# EAGLE board Motherboard (EAGLE 6.5.0)
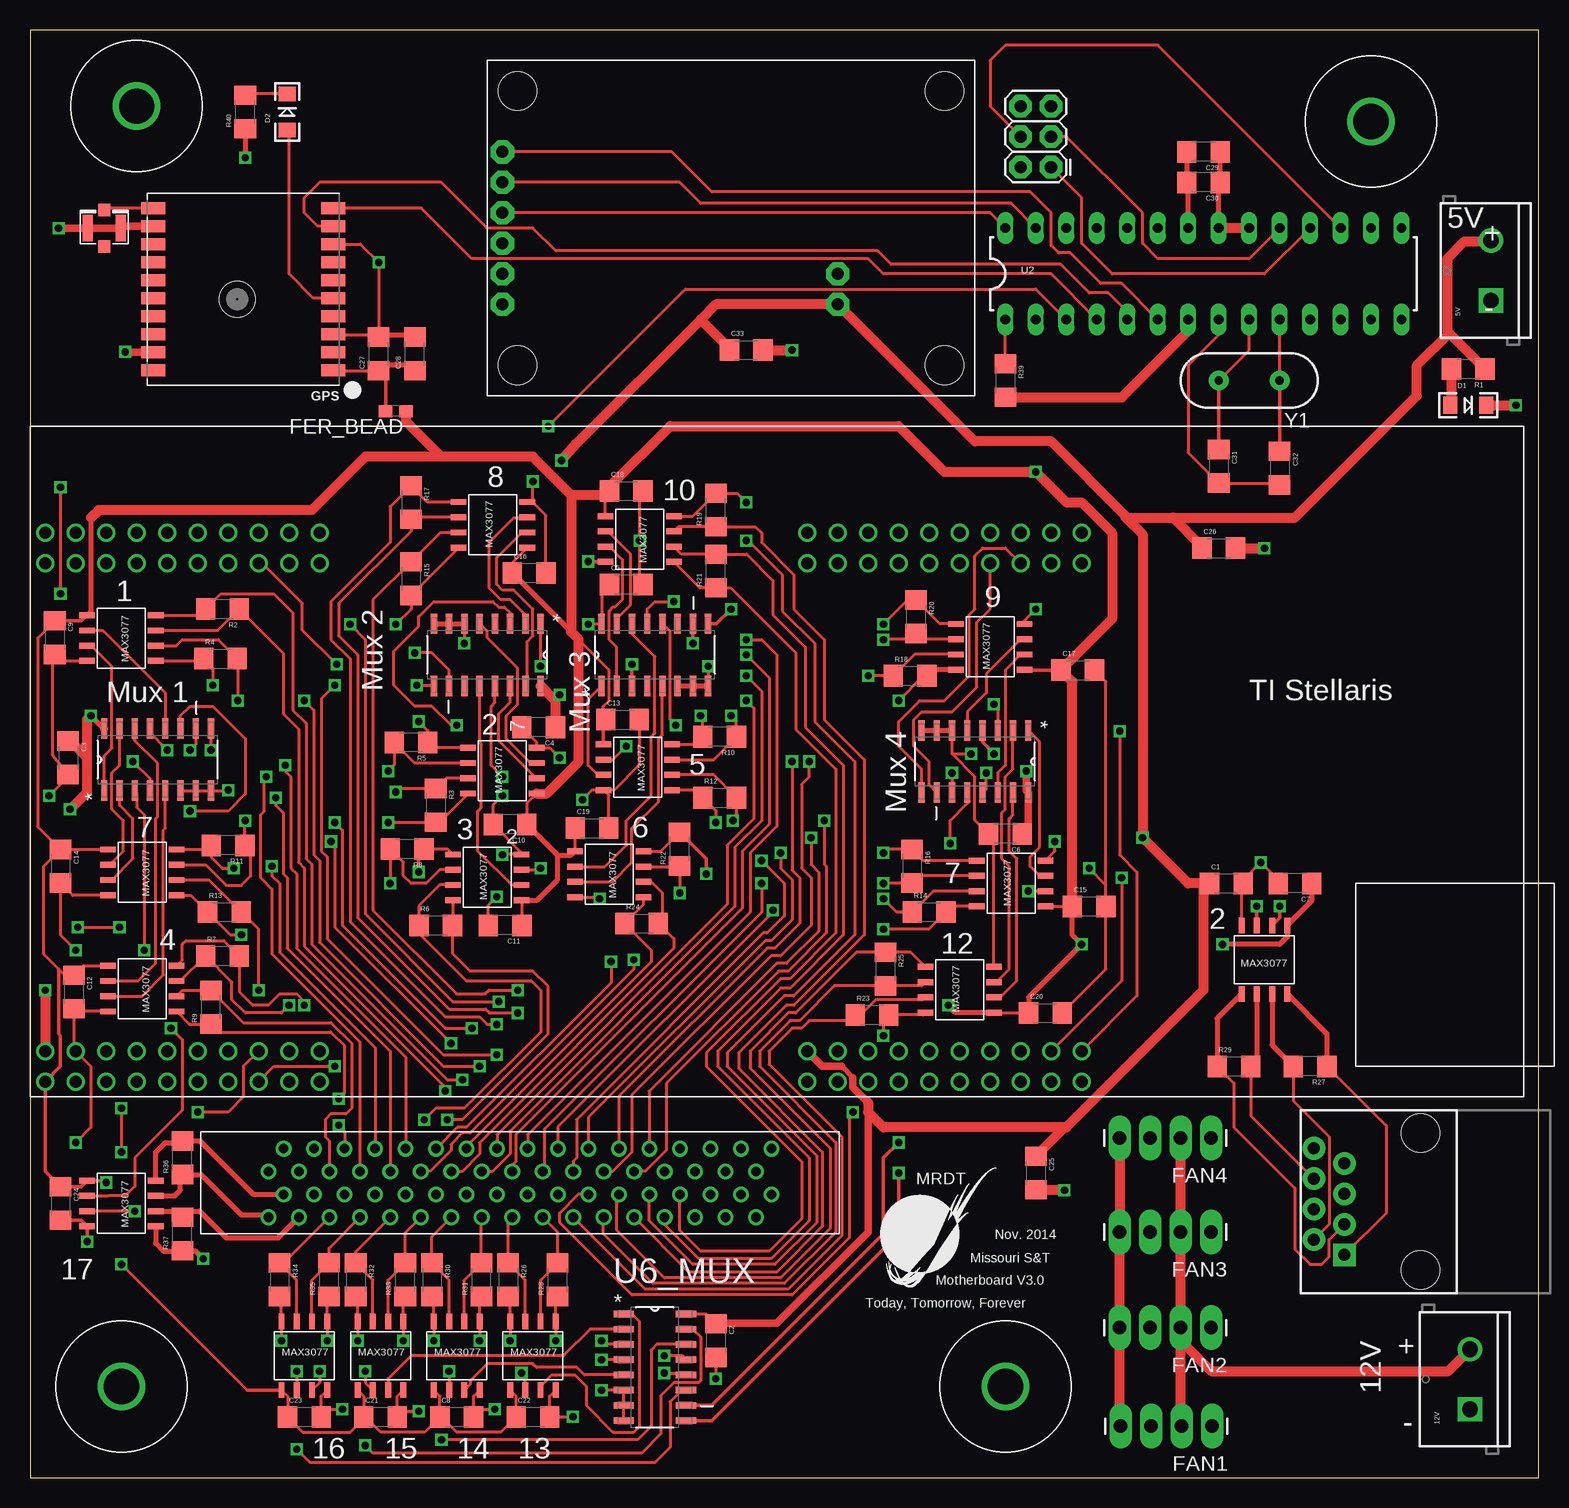
[diagram p7: board, top side]
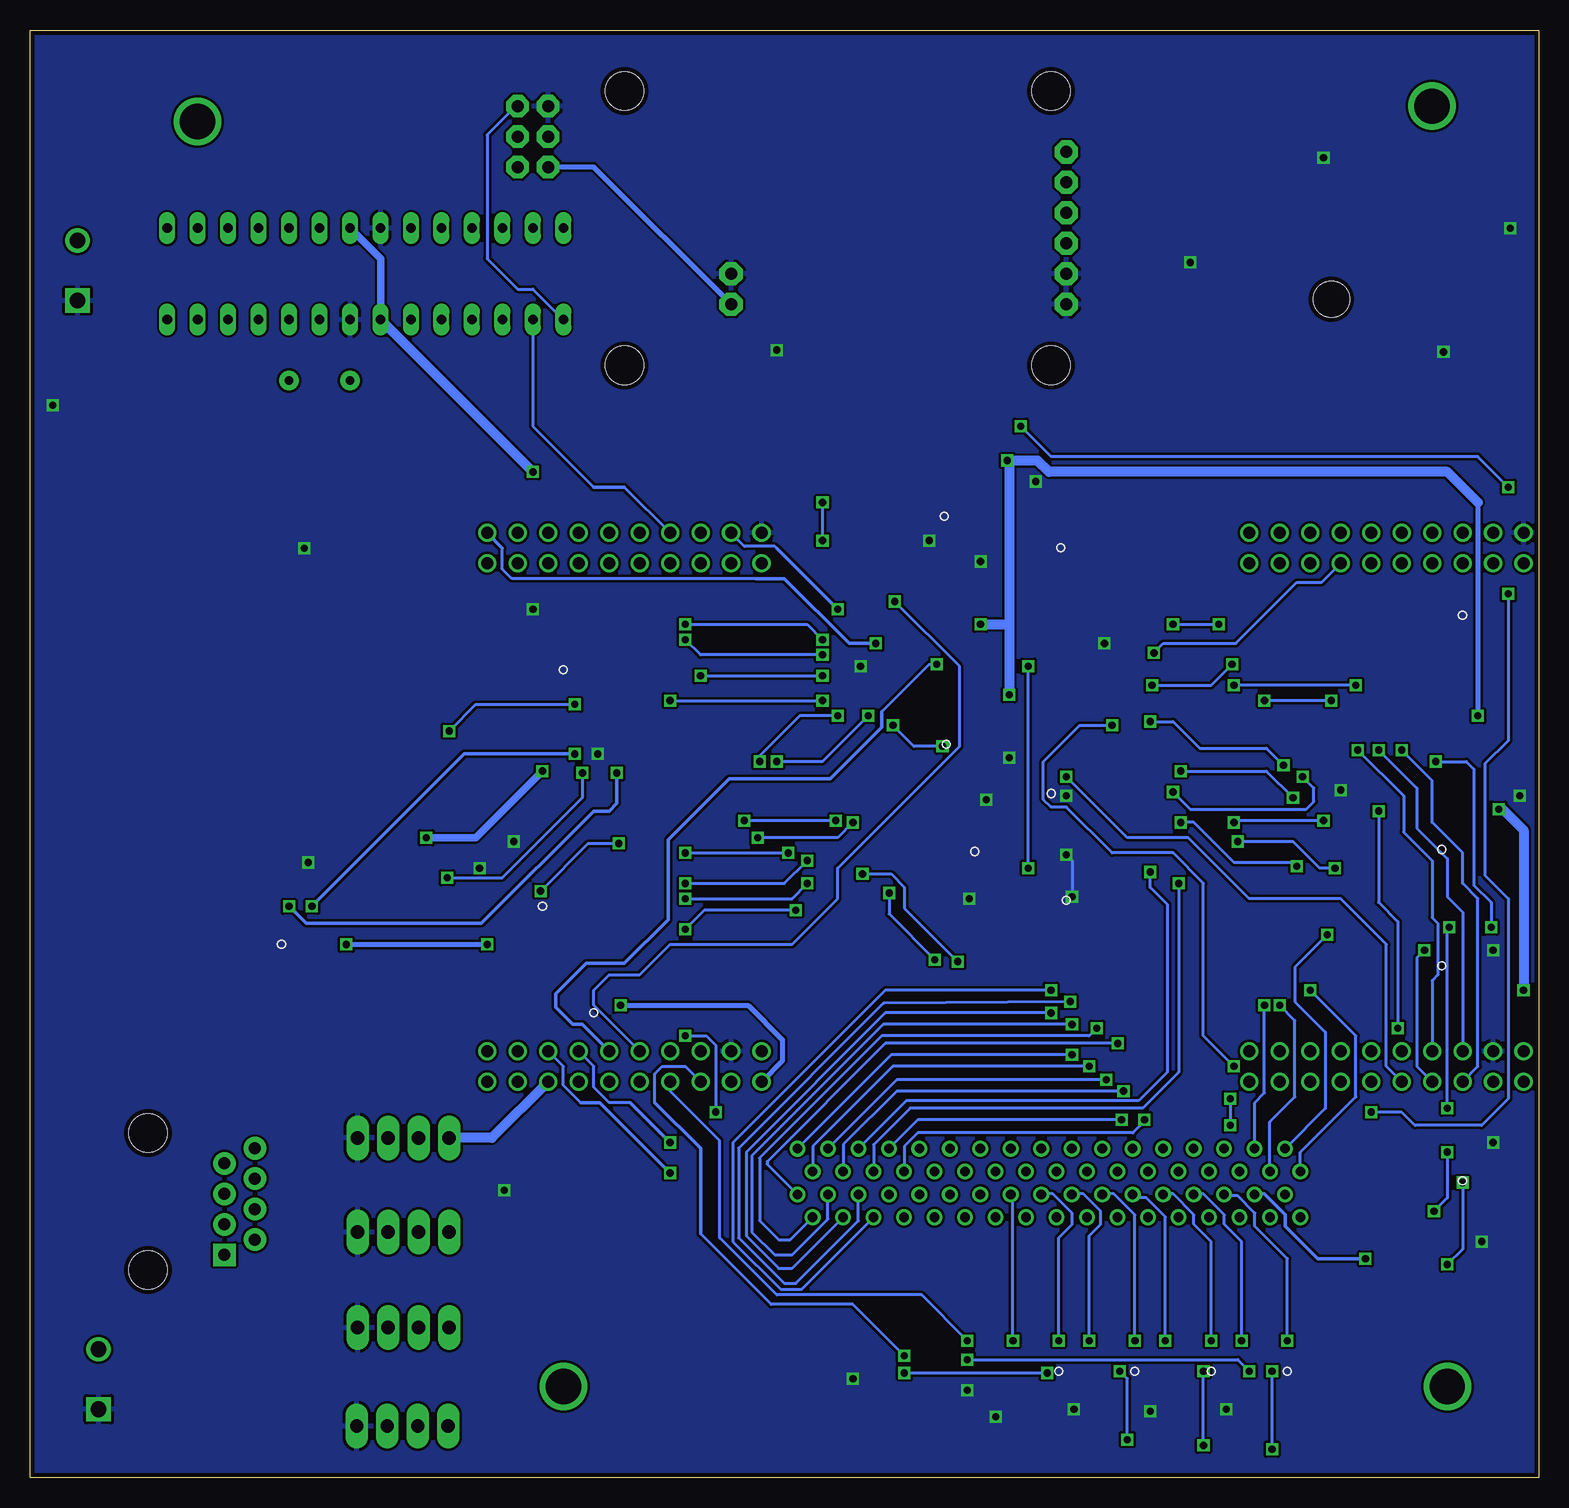
[diagram p8: board, bottom side, seen from below]

Size 125.73 x 120.65 mm. Coordinates in mm from the lower left corner, seen from the top.
Outline: 0,0 125.73,0 125.73,120.65 0,120.65 0,0
Copper layers (1*16): Top 0.035559375mm / dielectric 1.501140625mm / Bottom 0.035559375mm
Design rules "default": minimum track width 10mil, minimum drill 15mil, track to track 8mil, track to pad 6mil, pad to pad 6mil, via to via 6mil, smd to smd 6mil, copper to edge 15mil, drill to drill 8mil, minimum pad ring 10mil, minimum via ring 8mil, stop-mask expansion 4mil, vias tented up to drill 0mil, thermal gap 10mil
tRestrict: area 161,29.2 to 168.4,29.2

## Footprints (pad centres in the part's own frame; a part is rotated, then mirrored left to right if it is on the bottom)
SCREWTERMINAL-5MM-2 = drill 1.3 pad 2.032 square: 1 0,0 | drill 1.3 pad 2.032: 2 5,0
1206 = smd 1.6 x 1.8: 1 -1.4,0; 2 1.4,0
LED-1206 = smd 1.2 x 1.4: A -1.5,0; C 1.5,0
1X04_LONGPADS = drill 1.118 pad 1.88 long: 1 0,0; 2 2.54,0; 3 5.08,0; 4 7.62,0
0603 = smd 1.1 x 1: 1 -0.85,0; 2 0.85,0
FGPMMOPA6H = smd 2 x 1: P$1 -7.5,6.75; P$2 -7.5,5.25; P$3 -7.5,3.75; P$4 -7.5,2.25; P$5 -7.5,0.75; P$6 -7.5,-0.75; P$7 -7.5,-2.25; P$8 -7.5,-3.75; P$9 -7.5,-5.25; P$10 -7.5,-6.75; P$11 7.5,-6.75; P$12 7.5,-5.25; P$13 7.5,-3.75; P$14 7.5,-2.25; P$15 7.5,-0.75; P$16 7.5,0.75; P$17 7.5,2.25; P$18 7.5,3.75; P$19 7.5,5.25; P$20 7.5,6.75 | hole 3: 0.5,0.85
H_MNTHOLE_#4 = drill 2.946: 1 0,0
U.FL = smd 2.2 x 0.85: P$1 0,1.375; P$2 0,-1.375 | smd 1.05 x 1: P$3 1.525,0; P$4 -1.525,0
2X3 = drill 1.016 pad 1.88 octagon: 1 0,0; 2 0,2.54; 3 2.54,0; 4 2.54,2.54; 5 5.08,0; 6 5.08,2.54
MAX3070E = smd 0.49 x 1.3: A -1.905,2.857; B -0.635,2.857; DI 0.635,-2.857; GND 1.905,-2.857; RO -0.635,-2.857; VCC -1.905,-2.857; Y 1.905,2.857; Z 0.635,2.857
DIL28-3 = drill 0.813 long: 1 -16.51,-3.81; 2 -13.97,-3.81; 3 -11.43,-3.81; 4 -8.89,-3.81; 5 -6.35,-3.81; 6 -3.81,-3.81; 7 -1.27,-3.81; 8 1.27,-3.81; 9 3.81,-3.81; 10 6.35,-3.81; 11 8.89,-3.81; 12 11.43,-3.81; 13 13.97,-3.81; 14 16.51,-3.81; 15 16.51,3.81; 16 13.97,3.81; 17 11.43,3.81; 18 8.89,3.81; 19 6.35,3.81; 20 3.81,3.81; 21 1.27,3.81; 22 -1.27,3.81; 23 -3.81,3.81; 24 -6.35,3.81; 25 -8.89,3.81; 26 -11.43,3.81; 27 -13.97,3.81; 28 -16.51,3.81
SOIC127P600X175-16N = smd 1.702 x 0.533: 1 -2.591,4.445; 2 -2.591,3.175; 3 -2.591,1.905; 4 -2.591,0.635; 5 -2.591,-0.635; 6 -2.591,-1.905; 7 -2.591,-3.175; 8 -2.591,-4.445; 9 2.591,-4.445; 10 2.591,-3.175; 11 2.591,-1.905; 12 2.591,-0.635; 13 2.591,0.635; 14 2.591,1.905; 15 2.591,3.175; 16 2.591,4.445
RAZOR_IMU = drill 1 pad 1.93 octagon: 3.3V -19.05,-1.27; CTS -19.05,-3.81; DTR -19.05,6.35; GND_1 -19.05,-6.35; GND_2 8.89,-3.81; RXI -19.05,1.27; TXO -19.05,3.81; VCC 8.89,-6.35 | hole 3.2: -17.78,11.43; 17.78,11.43; 17.78,-11.43; -17.78,-11.43
RJ45-8 = drill 1 pad 1.88 square: 1 -4.445,6.35 | drill 1 pad 1.88: 2 -3.175,8.89; 3 -1.905,6.35; 4 -0.635,8.89; 5 0.635,6.35; 6 1.905,8.89; 7 3.175,6.35; 8 4.445,8.89 | hole 3.2: -5.715,0; 5.715,0
60050685100 = drill 0.8: 1 47.555,7.107; 2 46.285,5.202; 3 45.015,7.107; 4 43.745,5.202; 5 42.475,7.107; 6 41.205,5.202; 7 39.935,7.107; 8 38.665,5.202; 9 37.395,7.107; 10 36.125,5.202; 11 34.855,7.107; 12 33.585,5.202; 13 32.315,7.107; 14 31.045,5.202; 15 29.775,7.107; 16 28.505,5.202; 17 27.235,7.107; 18 25.965,5.202; 19 24.695,7.107; 20 23.425,5.202; 21 22.155,7.107; 22 20.885,5.202; 23 19.615,7.107; 24 18.345,5.202; 25 17.075,7.107; 26 15.805,5.202; 27 14.535,7.107; 28 13.265,5.202; 29 11.995,7.107; 30 10.725,5.202; 31 9.455,7.107; 32 8.185,5.202; 33 6.915,7.107; 34 5.645,5.202; 35 47.555,3.297; 36 46.285,1.393; 37 45.015,3.297; 38 43.745,1.393; 39 42.475,3.297; 40 41.205,1.393; 41 39.935,3.297; 42 38.665,1.393; 43 37.395,3.297; 44 36.125,1.393; 45 34.855,3.297; 46 33.585,1.393; 47 32.315,3.297; 48 31.045,1.393; 49 29.775,3.297; 50 28.505,1.393; 51 27.235,3.297; 52 25.965,1.393; 53 24.695,3.297; 54 23.425,1.393; 55 22.155,3.297; 56 20.885,1.393; 57 19.615,3.297; 58 18.345,1.393; 59 17.075,3.297; 60 15.805,1.393; 61 14.535,3.297; 62 13.265,1.393; 63 11.995,3.297; 64 10.725,1.393; 65 9.455,3.297; 66 8.185,1.393; 67 6.915,3.297; 68 5.645,1.393
STELLARISLAUNCHPAD_CONNECTED = drill 1: P1 36.83,54.61; P2 39.37,54.61; P3 41.91,54.61; P4 44.45,54.61; P5 46.99,54.61; P6 49.53,54.61; P7 52.07,54.61; P8 54.61,54.61; P9 57.15,54.61; P10 59.69,54.61; P11 36.83,52.07; P12 39.37,52.07; P13 41.91,52.07; P14 44.45,52.07; P15 46.99,52.07; P16 49.53,52.07; P17 52.07,52.07; P18 54.61,52.07; P19 57.15,52.07; P20 59.69,52.07; P21 100.33,54.61; P22 102.87,54.61; P23 105.41,54.61; P24 107.95,54.61; P25 110.49,54.61; P26 113.03,54.61; P27 115.57,54.61; P28 118.11,54.61; P29 120.65,54.61; P30 123.19,54.61; P31 100.33,52.07; P32 102.87,52.07; P33 105.41,52.07; P34 107.95,52.07; P35 110.49,52.07; P36 113.03,52.07; P37 115.57,52.07; P38 118.11,52.07; P39 120.65,52.07; P40 123.19,52.07; P41 36.83,11.43; P42 39.37,11.43; P43 41.91,11.43; P44 44.45,11.43; P45 46.99,11.43; P46 49.53,11.43; P47 52.07,11.43; P48 54.61,11.43; P49 57.15,11.43; P50 59.69,11.43; P51 36.83,8.89; P52 39.37,8.89; P53 41.91,8.89; P54 44.45,8.89; P55 46.99,8.89; P56 49.53,8.89; P57 52.07,8.89; P58 54.61,8.89; P59 57.15,8.89; P60 59.69,8.89; P61 100.33,11.43; P62 102.87,11.43; P63 105.41,11.43; P64 107.95,11.43; P65 110.49,11.43; P66 113.03,11.43; P67 115.57,11.43; P68 118.11,11.43; P69 120.65,11.43; P70 123.19,11.43; P71 100.33,8.89; P72 102.87,8.89; P73 105.41,8.89; P74 107.95,8.89; P75 110.49,8.89; P76 113.03,8.89; P77 115.57,8.89; P78 118.11,8.89; P79 120.65,8.89; P80 123.19,8.89
HC49US = drill 0.7 pad 1.651: 1 -2.54,0; 2 2.54,0

## Placement (x,y rotation side)
5V  M025MM  [SCREWTERMINAL-5MM-2]  121.76,98.11 90 top
12V  M025MM  [SCREWTERMINAL-5MM-2]  120.02,5.71 90 top
C1  0.1uF  [1206]  99.69,49.53 0 top
C2  0.1uF  [1206]  57.15,11.43 270 top
C3  0.1uF  [1206]  3.17,60.01 270 top
C4  0.1uF  [1206]  42.39,62.55 180 top
C5  0.1uF  [1206]  49.69,74.45 0 top
C6  0.1uF  [1206]  81.28,53.66 180 top
C7  0.1uF  [1206]  105.41,49.53 180 top
C8  0.1uF  [1206]  35.56,5.08 0 top
C9  0.1uF  [1206]  2.06,70.01 270 top
C10  0.1uF  [1206]  40.01,54.45 180 top
C11  0.1uF  [1206]  39.59,46.04 180 top
C12  0.1uF  [1206]  3.65,40.48 270 top
C13  0.1uF  [1206]  49.37,63.18 0 top
C14  0.1uF  [1206]  2.54,50.96 270 top
C15  0.1uF  [1206]  88.27,47.62 0 top
C16  0.1uF  [1206]  41.59,75.41 0 top
C17  0.1uF  [1206]  87.31,67.31 0 top
C18  0.1uF  [1206]  49.69,82.23 0 top
C19  0.1uF  [1206]  46.83,54.13 0 top
C20  0.1uF  [1206]  84.61,38.73 0 top
C21  0.1uF  [1206]  29.21,5.08 0 top
C22  0.1uF  [1206]  41.91,5.08 0 top
C23  0.1uF  [1206]  22.86,5.08 0 top
C24  0.1uF  [1206]  2.54,22.86 270 top
C25  0.1uF  [1206]  83.82,25.4 270 top
C26  0.1uF  [1206]  99.06,77.47 0 top
C27  .01uF  [1206]  29.05,93.66 90 top
C28  1uF  [1206]  32.07,93.66 90 top
C29  0.1uF  [1206]  97.79,110.49 180 top
C30  0.1uF  [1206]  97.79,107.95 180 top
C31  22pF  [1206]  99.06,84.3 270 top
C32  22pF  [1206]  104.14,84.14 270 top
C33  0.1uF  [1206]  59.69,93.98 0 top
D1  GREEN  [LED-1206]  119.86,89.38 0 top
D2  RED  [LED-1206]  21.43,113.82 90 top
FAN1  [1X04_LONGPADS]  98.5,4.3 180 top
FAN2  [1X04_LONGPADS]  98.42,12.51 180 top
FAN3  [1X04_LONGPADS]  98.42,20.48 180 top
FAN4  [1X04_LONGPADS]  98.42,28.32 180 top
FER_BEAD  10_ohm  [0603]  30.48,88.9 180 top
GPS  [FGPMMOPA6H]  17.78,99.06 180 top
H1  [H_MNTHOLE_#4]  81.28,7.62 0 top
H2  [H_MNTHOLE_#4]  7.62,7.62 0 top
H3  [H_MNTHOLE_#4]  111.76,113.03 0 top
H4  [H_MNTHOLE_#4]  8.89,114.3 0 top
J1  U.FL  [U.FL]  6.19,104.14 90 top
J2  AVR_SPI_PRG_6PTH  [2X3]  85.09,109.22 90 top
R1  330  [1206]  119.86,92.39 180 top
R2  120  [1206]  16.03,72.39 180 top
R3  120  [1206]  33.81,56.04 270 top
R4  120  [1206]  15.88,68.26 0 top
R5  120  [1206]  31.75,61.28 180 top
R6  120  [1206]  33.81,46.04 0 top
R7  120  [1206]  16.03,43.5 0 top
R8  120  [1206]  31.43,52.39 180 top
R9  120  [1206]  15.08,39.21 90 top
R10  120  [1206]  57.47,61.75 180 top
R11  120  [1206]  16.51,52.7 180 top
R12  120  [1206]  57.47,56.67 0 top
R13  120  [1206]  16.19,47.15 0 top
R14  120  [1206]  74.93,47.15 0 top
R15  120  [1206]  31.75,74.93 270 top
R16  120  [1206]  73.5,50.96 270 top
R17  120  [1206]  31.75,81.28 270 top
R18  120  [1206]  73.34,66.83 0 top
R19  120  [1206]  57.15,80.64 90 top
R20  120  [1206]  73.82,71.75 270 top
R21  120  [1206]  57.15,75.56 90 top
R22  120  [1206]  54.13,52.39 90 top
R23  120  [1206]  70.17,38.58 0 top
R24  120  [1206]  50.96,46.2 0 top
R25  120  [1206]  71.28,42.39 270 top
R26  120  [1206]  39.85,16.51 270 top
R27  120  [1206]  106.68,34.29 180 top
R28  120  [1206]  43.97,16.51 90 top
R29  120  [1206]  100.33,34.29 0 top
R30  120  [1206]  33.5,16.51 270 top
R31  120  [1206]  37.62,16.51 90 top
R32  120  [1206]  27.15,16.51 270 top
R33  120  [1206]  31.27,16.51 90 top
R34  120  [1206]  20.8,16.51 270 top
R35  120  [1206]  24.92,16.51 90 top
R36  120  [1206]  12.7,26.67 90 top
R37  120  [1206]  12.7,20.32 90 top
R39  10k  [1206]  81.28,91.44 270 top
R40  1K  [1206]  17.94,113.82 90 top
RS-485-2  MAX3077  [MAX3070E]  102.87,43.18 180 top
RS_TRANS_1  MAX3077  [MAX3070E]  7.62,69.98 270 top
RS_TRANS_2  MAX3077  [MAX3070E]  39.37,58.93 90 top
RS_TRANS_3  MAX3077  [MAX3070E]  38.1,50.04 90 top
RS_TRANS_4  MAX3077  [MAX3070E]  9.37,40.77 270 top
RS_TRANS_5  MAX3077  [MAX3070E]  50.64,59.21 270 top
RS_TRANS_6  MAX3077  [MAX3070E]  9.37,50.45 270 top
RS_TRANS_7  MAX3077  [MAX3070E]  81.76,49.53 90 top
RS_TRANS_8  MAX3077  [MAX3070E]  38.58,79.41 90 top
RS_TRANS_9  MAX3077  [MAX3070E]  80.01,69.25 90 top
RS_TRANS_10  MAX3077  [MAX3070E]  50.8,78.23 270 top
RS_TRANS_11  MAX3077  [MAX3070E]  48.26,50.29 270 top
RS_TRANS_12  MAX3077  [MAX3070E]  77.47,40.67 90 top
RS_TRANS_13  MAX3077  [MAX3070E]  41.91,10.16 0 top
RS_TRANS_14  MAX3077  [MAX3070E]  35.56,10.16 0 top
RS_TRANS_15  MAX3077  [MAX3070E]  29.21,10.16 0 top
RS_TRANS_16  MAX3077  [MAX3070E]  22.86,10.16 0 top
RS_TRANS_17  MAX3077  [MAX3070E]  7.62,22.86 270 top
U2  ATMEGA328P_PDIP  [DIL28-3]  97.79,100.33 0 top
U3_MUX  74HC4052D,653  [SOIC127P600X175-16N]  78.74,59.69 270 top
U4_MUX  74HC4052D,653  [SOIC127P600X175-16N]  52.07,68.58 90 top
U5_MUX  74HC4052D,653  [SOIC127P600X175-16N]  38.1,68.58 270 top
U6_MUX  74HC4052D,653  [SOIC127P600X175-16N]  52.07,9.21 0 top
U7_MUX  74HC4052D,653  [SOIC127P600X175-16N]  10.64,59.85 90 top
U$1  RAZOR_IMU  [RAZOR_IMU]  58.42,104.14 0 top
U$2  RJ45-8PTH  [RJ45-8]  115.89,23.02 90 top
U$4  TB60050685100  [60050685100]  14.22,20.32 0 top
U$5  STELLARISLAUNCHPAD_CONNECTED  [STELLARISLAUNCHPAD_CONNECTED]  124.46,87.63 180 top
Y1  8MHz  [HC49US]  101.6,91.44 180 top

## Tracks (layer width: path | path; a pad name or v marks a point on that pad's centre or on a via)
1_RX+  (via drill 0.6)
  Top 0.254: v36.04,33.18 34.77,33.18 23.5,44.45 23.5,51.12 23.02,51.59 23.02,62.87 21.91,63.98 21.91,72.07 20.32,73.66 15.9,73.66 R2.2 14.13,71.88 RS_TRANS_1.A
  Bottom 0.254: v36.04,33.18 53.49,33.18 U$4.3
1_RX-  (via drill 0.6)
  Top 0.254: v34.61,32.23 34.61,32.54 22.86,44.29 22.86,50.8 22.38,51.28 22.38,62.39 21.11,63.66 21.11,68.71 R2.1 15.66,70.61 RS_TRANS_1.B
  Bottom 0.254: v34.61,32.23 53.5,32.23 57.94,27.78 57.94,25.55 U$4.4
1_TX+  (via drill 0.6)
  Top 0.254: v15.24,66.04 15.24,67.5 R4.1 14.28,68.07 RS_TRANS_1.Y | v25.4,66.04 24.29,64.93 24.29,52.23 24.77,51.75 24.77,44.93 34.45,35.24 v38.89,35.24
  Bottom 0.254: v15.24,66.04 v25.4,66.04 | v38.89,35.24 53.96,35.24 U$4.1
1_TX-  (via drill 0.6)
  Top 0.254: v17.3,64.77 17.3,68.23 R4.2 15.69,69.85 12.7,69.85 12.19,69.34 RS_TRANS_1.Z | v22.86,64.77 23.65,63.98 23.65,51.91 24.13,51.44 24.13,44.61 34.45,34.29 v37.47,34.29
  Bottom 0.254: v17.3,64.77 v22.86,64.77 | v37.47,34.29 53.82,34.29 60.48,27.62 60.48,25.55 U$4.2
2_RX+  (via drill 0.6)
  Top 0.254: RS_TRANS_3.A 35.24,46.07 R6.2 | R6.2 35.53,45.72 35.56,45.72 | v34.77,29.84 36.04,29.84 43.18,36.99 43.18,40.96 41.91,42.23 36.67,42.23 35.24,43.66 35.24,46.01 R6.2
  Bottom 0.254: v34.77,29.84 51.74,29.84 U$4.7
2_RX-  (via drill 0.6)
  Top 0.254: RS_TRANS_3.B 34.16,49.4 32.41,47.65 R6.1 32.41,45.37 36.35,41.43 41.75,41.43 42.55,40.64 42.55,37.15 36.2,30.8 33.81,30.8 v32.86,29.84
  Bottom 0.254: v32.86,29.84 32.86,29.69 33.81,28.73 51.75,28.73 52.86,27.62 52.86,25.55 U$4.8
2_TX+  (via drill 0.6)
  Top 0.254: RS_TRANS_3.Y 34.8,52.39 R8.1 32.38,51.94 v32.38,50.48
  Bottom 0.254: U$4.5 52.69,31.43 33.34,31.43 30.96,33.81 30.96,47.78 32.38,49.21 v32.38,50.48
2_TX-  (via drill 0.6)
  Top 0.254: v30,49.53 30.03,49.56 R8.2 31.11,51.3 31.11,50.16 31.75,49.53 33.02,49.53 34.16,50.67 RS_TRANS_3.Z
  Bottom 0.254: v30,49.53 30,33.81 33.02,30.8 52.39,30.8 55.43,27.76 U$4.6
3_RX+  (via drill 0.6)
  Top 0.254: v63.5,59.69 63.5,50.64 64.14,50.01 64.14,46.2 62.07,44.13 61.44,44.13 49.08,31.77 U$4.11 | RS_TRANS_5.A 55.43,61.12 R10.2 56.07,63.31 v55.88,63.5
  Bottom 0.254: v55.88,63.5 59.69,59.69 v63.5,59.69
3_RX-  (via drill 0.6)
  Top 0.254: v58.42,63.5 58.87,63.05 R10.1 56.96,59.85 RS_TRANS_5.B | U$4.12 48.54,25.52 50.16,27.15 50.16,31.91 61.75,43.5 62.55,43.5 65.09,46.04 65.09,50.01 64.29,50.8 64.29,57.78 64.93,58.42 v64.93,59.69
  Bottom 0.254: v58.42,63.5 61.59,63.5 64.93,60.17 v64.93,59.69
3_TX+  (via drill 0.6)
  Top 0.254: RS_TRANS_5.Y 55.43,57.31 R12.1 57.15,55.59 v57.15,54.61 | v65.09,53.34 65.09,51.12 65.72,50.48 65.72,45.56 63.02,42.86 62.23,42.86 51.59,32.23 51.59,27.45 U$4.9
  Bottom 0.254: v57.15,54.61 58.42,53.34 v65.09,53.34
3_TX-  (via drill 0.6)
  Top 0.254: RS_TRANS_5.Z 56.96,58.58 R12.2 58.87,54.8 v58.58,54.77 | v66.2,54.77 66.2,51.12 66.36,50.96 66.36,45.4 63.18,42.23 62.39,42.23 53.02,32.86 53.02,27.3 51.28,25.56 50.38,25.56 U$4.10
  Bottom 0.254: v58.58,54.77 v66.2,54.77
4_RX+  (via drill 0.6)
  Top 0.254: RS_TRANS_7.A 76.81,47.62 R14.2 74.9,45.72 v71.12,45.72 | U$4.15 44,29.23 61.91,47.15 v61.91,47.31
  Bottom 0.254: v71.12,45.72 69.53,47.31 v61.91,47.31
4_RX-  (via drill 0.6)
  Top 0.254: RS_TRANS_7.B 75.28,48.9 R14.1 72.23,47.15 v71.12,48.26 | v60.96,49.53 60.96,47.15 42.86,29.05 42.86,25.66 U$4.16
  Bottom 0.254: v71.12,48.26 62.23,48.26 v60.96,49.53
4_TX+  (via drill 0.6)
  Top 0.254: RS_TRANS_7.Y 74.42,51.44 R16.1 71.41,52.36 v71.12,52.07 | v62.55,52.07 62.55,50.8 63.5,49.85 63.5,46.51 61.75,44.77 61.28,44.77 46.54,30.03 U$4.13
  Bottom 0.254: v71.12,52.07 v62.55,52.07
4_TX-  (via drill 0.6)
  Top 0.254: RS_TRANS_7.Z 74.11,50.16 R16.2 71.15,49.56 v71.12,49.53 | v60.96,51.44 62.87,49.53 62.87,46.83 61.44,45.4 61.12,45.4 45.56,29.84 45.56,26.67 45.27,26.38 U$4.14
  Bottom 0.254: v71.12,49.53 62.87,49.53 v60.96,51.44
5_RX+  (via drill 0.6)
  Top 0.254: v59.69,64.77 60.33,64.14 60.33,54.93 58.1,52.7 58.1,47.78 38.92,28.6 U$4.19 | v72.39,64.77 74.45,66.83 R18.2
  Top 0.406: RS_TRANS_9.A 75.25,67.34 R18.2
  Bottom 0.254: v72.39,64.77 v59.69,64.77
5_RX-  (via drill 0.6)
  Top 0.254: RS_TRANS_9.B 73.72,68.61 R18.1 v69.85,66.83 | v59.69,66.83 60.96,65.56 60.96,54.77 58.74,52.55 58.74,47.62 40.01,28.89 40.01,26.99 38.54,25.52 U$4.20
  Bottom 0.254: v69.85,66.83 v59.69,66.83
5_TX+  (via drill 0.6)
  Top 0.254: v71.12,71.12 73.16,73.16 R20.1 75.82,71.15 RS_TRANS_9.Y | v59.69,69.85 60.96,69.85 62.23,68.58 62.23,54.29 60.01,52.07 60.01,47.15 41.46,28.6 U$4.17
  Bottom 0.254: v71.12,71.12 60.96,71.12 v59.69,69.85
5_TX-  (via drill 0.6)
  Top 0.254: RS_TRANS_9.Z 74.29,69.88 | 74.29,69.88 R20.2 | 74.29,69.88 71.15,69.88 v71.12,69.85 | v59.69,68.58 61.59,66.67 61.59,54.45 59.37,52.23 59.37,47.47 40.48,28.57 40.48,26.35 40.19,26.06 U$4.18
  Bottom 0.254: v59.69,68.58 69.85,68.58 v71.12,69.85
6_RX+  (via drill 0.6)
  Top 0.254: 54.16,53.79 R22.2 52.54,52.2 RS_TRANS_11.A | v48.42,43.02 48.42,41.27 36.35,29.21 35.62,29.21 U$4.23
  Top 0.305: 54.16,53.79 56.36,51.59 v56.36,50.32
  Bottom 0.254: v48.42,43.02 52.86,47.47 52.86,49.21 53.98,50.32 v56.36,50.32
6_RX-  (via drill 0.6)
  Top 0.254: v54.13,48.74 R22.1 54.07,50.93 RS_TRANS_11.B | v50.32,43.18 50.32,42.39 36.67,28.73 36.04,28.73 35.08,27.78 35.08,27.3 33.34,25.56 32.6,25.56 U$4.24
  Bottom 0.254: v54.13,48.74 54.13,46.99 v50.32,43.18
6_TX+
  Top 0.254: RS_TRANS_11.Y 51.12,47.76 R24.1 49.56,46.17 51.75,43.97 51.75,43.02 36.38,27.65 U$4.21
6_TX-
  Top 0.254: RS_TRANS_11.Z 51.78,49.66 52.7,48.74 52.7,46.54 R24.2 52.39,46.2 53.66,44.93 53.66,44.13 37.47,27.94 37.47,26.99 36,25.52 U$4.22
7_RX+  (via drill 0.6)
  Top 0.254: v20.16,50.96 20.16,50.16 20.8,49.53 20.8,43.81 28.76,35.85 U$4.27 | RS_TRANS_2.A 34.13,54.64 R3.2 29.87,54.64 v29.84,54.61
  Bottom 0.254: v20.16,50.96 20.48,51.28 25.4,51.28 28.73,54.61 v29.84,54.61
7_RX-  (via drill 0.6)
  Top 0.254: RS_TRANS_2.B 34.67,58.29 R3.1 30.77,57.44 v30.48,57.15 | U$4.28 27.49,36.33 20.16,43.66 20.16,49.05 19.21,50.01 19.21,55.24 19.53,55.56 19.53,58.26 v19.68,58.42
  Bottom 0.254: v30.48,57.15 29.05,55.72 19.37,55.72 18.73,56.36 18.73,57.47 v19.68,58.42
7_TX+  (via drill 0.6)
  Top 0.254: v21.27,59.37 21.27,58.9 21.75,58.42 21.75,50.8 22.23,50.32 22.23,44.13 31.3,35.06 U$4.25 | RS_TRANS_2.Y 33.59,60.83 R5.1 33.15,62.26 v32.38,63.02
  Bottom 0.254: v21.27,59.37 22.7,60.8 28.26,60.8 30.48,63.02 v32.38,63.02
7_TX-  (via drill 0.6)
  Top 0.254: v29.84,58.9 30.35,59.4 R5.2 32.06,59.56 RS_TRANS_2.Z | v20.48,56.67 20.48,56.04 21.11,55.4 21.11,50.32 21.43,50.01 21.43,44.13 30,35.56 30,25.55 U$4.26
  Bottom 0.254: v29.84,58.9 22.7,58.9 v20.48,56.67
8_RX+  (via drill 0.6)
  Top 0.254: RS_TRANS_4.A 12.7,43.15 12.7,44.45 13.02,44.77 16.16,44.77 R7.2 17.46,43.47 17.46,40.48 18.57,39.37 19.84,39.37 20.8,40.32 22.23,40.32 22.86,39.69 v22.86,39.37
  Bottom 0.254: U$4.31 23.68,31.25 22.86,32.07 v22.86,39.37
8_RX-  (via drill 0.6)
  Top 0.254: RS_TRANS_4.B 12.54,41.4 R7.1 16.83,41.3 16.83,39.85 17.94,38.73 20.95,38.73 v21.59,39.37
  Bottom 0.254: U$4.32 22.41,29.66 20.32,31.75 20.32,38.1 v21.59,39.37
8_TX+  (via drill 0.6)
  Top 0.254: RS_TRANS_4.Y 13.27,37.81 R9.1 15.74,37.15 25.08,37.15 26.19,36.04 26.19,32.07 v25.72,31.59 | U$4.29 26.22,28.87 v25.72,29.37
  Bottom 0.254: v25.72,31.59 v25.72,29.37
8_TX-
  Top 0.254: RS_TRANS_4.Z 12.7,40.61 R9.2 17.75,37.94 25.08,37.94 26.83,36.2 26.83,30.8 26.35,30.32 25.08,30.32 24.61,29.84 24.61,28.42 24.95,28.07 U$4.30
9_RX+  (via drill 0.6)
  Top 0.254: v35.08,36.2 25.4,45.88 25.4,52.7 v25.08,53.02 | RS_TRANS_6.A 14.76,52.36 R11.2 15.11,51.72 16.03,50.8 v16.99,50.8
  Bottom 0.254: v35.08,36.2 54.45,36.2 64.29,26.35 64.29,26.13 U$4.35 | v16.99,50.8 18.26,50.8 20.48,53.02 v25.08,53.02
9_RX-  (via drill 0.6)
  Top 0.254: v17.94,54.77 17.91,53.84 R11.1 18.41,52.2 18.41,50.16 17.62,49.37 16.35,49.37 14.64,51.09 RS_TRANS_6.B | v25.4,54.61 26.04,53.98 26.04,46.04 34.61,37.47 v36.83,37.47
  Bottom 0.254: v36.83,37.47 37.47,36.83 54.77,36.83 64.93,26.67 64.93,21.43 63.34,19.84 62.38,19.84 U$4.36 | v17.94,54.77 25.24,54.77 v25.4,54.61
9_TX+  (via drill 0.6)
  Top 0.254: 14.13,47.15 R13.1 | RS_TRANS_6.Y 13.4,48.55 R13.1 | R13.1 16.7,45.24 v17.62,45.24
  Bottom 0.254: v17.62,45.24 20.32,42.55 20.32,39.69 17.78,37.15 17.78,30.79 U$4.33
9_TX-  (via drill 0.6)
  Top 0.254: v19.05,40.64 19.05,45.72 17.62,47.15 R13.2 14.93,49.82 RS_TRANS_6.Z
  Bottom 0.254: U$4.34 19.87,27.12 15.24,31.75 15.24,36.83 v19.05,40.64
10_RX+  (via drill 0.6)
  Top 0.254: v30.48,71.12 31.75,72.39 R15.2 RS_TRANS_8.A | v26.67,71.12 27.94,69.85 27.94,46.99 35.24,39.69 v39.05,39.69
  Bottom 0.254: v30.48,71.12 v26.67,71.12 | v39.05,39.69 54.61,39.53 66.67,27.46 66.67,20 62.87,16.19 61.91,16.19 56.7,21.41 U$4.39
10_RX-  (via drill 0.6)
  Top 0.254: v40.64,40.64 38.26,40.64 37.94,40.32 35.56,40.32 28.57,47.31 28.57,73.16 R15.1 34.19,78.77 RS_TRANS_8.B
  Bottom 0.254: v40.64,40.64 54.45,40.64 67.15,27.94 67.15,19.68 63.18,15.72 61.42,15.72 U$4.40
10_TX+  (via drill 0.6)
  Top 0.254: v38.89,37.78 38.1,37.78 37.47,38.42 34.61,38.42 26.67,46.35 26.67,68.26 25.08,69.85 25.08,73.03 30,77.95 30,80.93 R17.1 33.12,81.31 RS_TRANS_8.Y
  Bottom 0.254: v38.89,37.78 54.61,37.78 65.56,26.83 65.56,20.48 63.66,18.57 62.23,18.57 59.24,21.57 U$4.37
10_TX-  (via drill 0.6)
  Top 0.254: v40.64,38.73 38.26,38.73 37.94,39.05 34.92,39.05 27.3,46.67 27.3,68.58 25.72,70.17 25.72,72.87 31.75,78.9 R17.2 31.91,80.04 RS_TRANS_8.Z
  Bottom 0.254: v40.64,38.73 54.45,38.73 66.04,27.15 66.04,20.16 63.34,17.46 62.22,17.46 U$4.38
11_RX+  (via drill 0.6)
  Top 0.254: R19.2 57.66,82.05 | v59.69,81.28 58.92,82.05 R19.2 | v59.69,78.11 59.85,78.11 62.71,75.25 62.71,72.23 65.41,69.53 65.41,63.02 68.74,59.69 68.74,45.24 63.66,40.16 62.87,40.16 58.1,35.4 58.1,34.29 65.56,26.83 65.56,21.27 62.07,17.78 55.24,17.78 51.59,21.43 51.59,23.59 U$4.43 | RS_TRANS_10.A 55.24,80.14 R19.2
  Bottom 0.254: v59.69,81.28 v59.69,78.11
11_RX-
  Top 0.254: U$4.44 54.92,17.14 62.23,17.14 66.04,20.95 66.04,27.15 59.05,34.13 59.05,35.4 63.02,39.37 63.66,39.37 69.53,45.24 69.53,59.85 66.2,63.18 66.2,69.85 63.66,72.39 63.66,75.25 60.96,77.95 60.96,78.74 60.45,79.25 R19.1 54.03,79.25 RS_TRANS_10.B
11_TX+
  Top 0.254: RS_TRANS_10.Y 55.82,74.17 R21.1 58.39,74.17 63.82,68.74 63.82,62.39 67.15,59.05 67.15,45.4 63.34,41.59 62.55,41.59 56.36,35.4 56.36,34.29 64.29,26.35 64.29,21.59 61.59,18.89 55.88,18.89 54.13,20.64 54.13,23.59 U$4.41
11_TX-
  Top 0.254: RS_TRANS_10.Z 54.29,76.97 R21.2 59.72,76.97 61.91,74.77 61.91,71.91 64.61,69.22 64.61,62.55 67.79,59.37 67.79,45.24 63.34,40.8 62.55,40.8 57.31,35.56 57.31,34.29 64.93,26.67 64.93,21.43 61.75,18.26 55.72,18.26 52.89,21.09 U$4.42
12_RX+  (via drill 0.6)
  Top 0.254: RS_TRANS_12.A 74.42,38.58 R23.2 71.12,38.58 v71.12,36.83 | v68.58,30.48 68.26,30.16 68.26,20 63.5,15.24 50.16,15.24 44.13,21.27 44.13,22.07 45.72,23.65 46.5,23.65 U$4.47
  Bottom 0.254: v71.12,36.83 69.37,36.83 68.58,36.04 v68.58,30.48
12_RX-
  Top 0.254: RS_TRANS_12.B 74.42,39.85 70.48,39.85 69.22,38.58 R23.1 68.77,38.29 68.58,38.1 64.93,38.1 64.29,37.47 63.5,37.47 61.59,35.56 61.59,34.45 67.63,28.42 67.63,20.16 63.18,15.72 51.27,15.72 U$4.48
12_TX+
  Top 0.254: RS_TRANS_12.Y 73.4,43.79 R25.1 68.87,43.79 63.82,38.73 63.18,38.73 60.01,35.56 60.01,34.13 66.67,27.46 66.67,20.8 62.55,16.67 52.86,16.67 48.9,20.64 48.9,23.43 U$4.45
12_TX-
  Top 0.254: RS_TRANS_12.Z 74.29,40.99 R25.2 67.02,40.99 64.14,38.1 63.34,38.1 60.8,35.56 60.8,34.29 67.15,27.94 67.15,20.48 62.87,16.19 51.91,16.19 47.78,20.32 47.78,21.69 U$4.46 47.81,21.41
13_RX+  (via drill 0.6)
  Top 0.254: v40.01,11.43 RS_TRANS_13.A 40.01,14.95 R26.2
  Bottom 0.254: v40.01,11.43 40.01,20 38.89,21.11 38.89,22.07 40.48,23.65 41.42,23.65 U$4.51
13_RX-
  Top 0.254: RS_TRANS_13.B 41.27,16.48 R26.1 39.85,21.37 U$4.52
13_TX+  (via drill 0.6)
  Top 0.254: v43.81,11.43 RS_TRANS_13.Y 43.81,14.95 R28.1
  Bottom 0.254: v43.81,11.43 43.81,23.43 U$4.49
13_TX-
  Top 0.254: RS_TRANS_13.Z 42.55,16.48 R28.2 43.97,20.47 U$4.50
14_RX+  (via drill 0.6)
  Top 0.254: v33.66,11.43 RS_TRANS_14.A 33.66,14.95 R30.2
  Bottom 0.254: v33.66,11.43 33.66,21.91 35.4,23.65 36.34,23.65 U$4.55
14_RX-
  Top 0.254: RS_TRANS_14.B 34.92,16.48 R30.1 33.5,20.1 U$4.56
14_TX+  (via drill 0.6)
  Top 0.254: v37.47,11.43 RS_TRANS_14.Y 37.47,14.95 R31.1
  Bottom 0.254: v37.47,11.43 37.47,20.16 36.51,21.11 36.51,22.23 37.94,23.65 38.88,23.65 U$4.53
14_TX-
  Top 0.254: RS_TRANS_14.Z 36.2,16.48 R31.2 37.62,21.69 U$4.54
15_RX+  (via drill 0.6)
  Top 0.254: v27.3,11.43 RS_TRANS_15.A 27.3,14.95 R32.2
  Bottom 0.254: v27.3,11.43 27.3,19.68 28.73,21.11 28.73,21.91 30.48,23.65 31.26,23.65 U$4.59
15_RX-
  Top 0.254: RS_TRANS_15.B 28.57,16.48 R32.1 27.15,18.83 U$4.60
15_TX+  (via drill 0.6)
  Top 0.254: v31.11,11.43 RS_TRANS_15.Y 31.11,14.95 R33.1
  Bottom 0.254: v31.11,11.43 31.11,21.75 32.7,23.34 33.56,23.34 U$4.57
15_TX-
  Top 0.254: RS_TRANS_15.Z 29.84,16.48 R33.2 31.27,20.42 U$4.58
16_RX+  (via drill 0.6)
  Top 0.254: v20.95,11.43 RS_TRANS_16.A 20.95,14.95 R34.2
  Bottom 0.254: v20.95,11.43 20.95,18.26 23.65,20.95 23.65,22.07 25.08,23.5 26.1,23.5 U$4.63
16_RX-
  Top 0.254: RS_TRANS_16.B 22.23,16.48 R34.1 21.15,17.91 U$4.64
16_TX+  (via drill 0.6)
  Top 0.254: v24.77,11.43 RS_TRANS_16.Y 24.77,14.95 R35.1
  Bottom 0.254: v24.77,11.43 24.77,19.68 26.19,21.11 26.19,21.91 27.94,23.65 28.72,23.65 U$4.61
16_TX-
  Top 0.254: RS_TRANS_16.Z 23.5,16.48 R35.2 24.92,19.15 U$4.62
17_RX+
  Top 0.406: RS_TRANS_17.A 10.48,27.15 11.27,27.94 12.57,27.94 R36.2 14.16,28.07 18.61,23.62 U$4.67
17_RX-
  Top 0.406: RS_TRANS_17.B 12.06,23.5 12.54,23.97 12.54,25.11 R36.1 14.26,25.27 17.62,21.91 19.67,21.91 U$4.68
17_TX+  (via drill 0.6)
  Top 0.305: 14.45,18.44 v14.45,18.26
  Top 0.406: RS_TRANS_17.Y 10.48,19.53 11.11,18.89 12.67,18.89 R37.1 13.78,18.92 v14.45,18.26
  Bottom 0.305: v14.45,18.26 18.41,18.26 21.11,20.95 21.11,21.91 22.86,23.65 23.64,23.65 U$4.65
17_TX-
  Top 0.305: 22.41,21.14 U$4.66 | 13.46,22.23 R37.2
  Top 0.406: RS_TRANS_17.Z 12.2,22.23 R37.2 | 13.46,22.23 14.13,22.23 16.35,20 20.7,20 U$4.66
+3V3  (via drill 0.6)
  Top 0.254: RS_TRANS_10.VCC 47.94,81.89 C18.1 | RS_TRANS_2.VCC 41.41,56.2 C10.1 | RS_TRANS_11.VCC 45.43,52.23 C19.1 | RS_TRANS_3.VCC 40.99,48.1 C11.1 | RS_TRANS_12.VCC 80.36,38.73 C20.1 | RS_TRANS_7.VCC C15.1 | RS_TRANS_6.VCC C14.1 | C14.1 0.64,54.26 0.64,69.98 C9.1 | RS_TRANS_4.VCC 4.44,42.67 C12.1 2.89,41.88 2.38,42.39 1.11,43.66 1.11,50.92 C14.1 | RS_TRANS_8.VCC 40.19,76.26 C16.1 | RS_TRANS_16.VCC 21.46,6.8 C23.1 22.73,3.81 26.67,3.81 27.81,4.95 C21.1 | RS_TRANS_15.VCC 27.81,6.8 C21.1 | C8.1 32.89,3.81 29.21,3.81 27.94,5.08 C21.1 | C8.1 34.29,5.08 35.56,3.81 39.24,3.81 C22.1 40.51,6.8 RS_TRANS_13.VCC | C8.1 34.16,6.8 RS_TRANS_14.VCC | 5.71,24.77 v6.35,24.61 | v7.62,17.78 18.1,7.3 | RS_TRANS_5.VCC 47.78,64.29 48.26,64.77 48.26,67.31 45.72,69.85
  Top 0.305: RS_TRANS_1.VCC 4.29,71.41 C9.1 | C13.1 47.78,62.99 RS_TRANS_5.VCC | 2.38,42.39 2.38,36.99 2.54,36.83 2.54,34.29 U$5.P30 1.27,25.53 C24.1 4.26,24.26 RS_TRANS_17.VCC 5.71,24.77 | RS_TRANS_16.VCC 18.1,7.3 | RS_TRANS_9.VCC 82.9,67.31 C17.1
  Top 0.406: C7.1 106.81,48.07 RS-485-2.VCC 104.78,45.09 104.14,44.45 v99.38,44.45 | C15.1 86.86,45.22 v87.63,44.45 83.21,40.03 C20.1 | RS_TRANS_3.VCC 42.26,48.13 43.97,49.85 43.97,51.88 | 43.97,51.88 C10.1 | 43.97,51.88 45.09,51.88 RS_TRANS_11.VCC | 45.72,69.85 45.72,69.88 | C16.1 45.1,70.5 45.11,70.51 | FER_BEAD.1 31.33,88.48 | U2.21 99.06,107.82 C30.1 C29.1 | 5.08,80.01 5.08,72.2 RS_TRANS_1.VCC | RS_TRANS_12.VCC 77.12,38.77 v76.52,39.37
  Top 0.61: 48.29,82.58 C18.1
  Top 0.813: C15.1 86.86,66.36 C17.1 90.17,71.57 90.17,78.74 87.63,81.28 86.36,81.28 v83.82,83.82 76.2,83.82 72.39,87.63 53.34,87.63 48.29,82.58 | RS_TRANS_2.VCC 43.05,57.02 45.72,59.69 45.72,69.85 | 45.72,69.88 45.1,70.5 | 45.11,81.89 45.11,70.51 | 47.94,81.89 45.11,81.89 | U2.20 U2.21 | 5.08,80.01 5.71,80.64 23.5,80.64 27.94,85.09 34.29,85.09 | 45.11,81.89 41.91,85.09 34.29,85.09 | 31.33,88.48 31.33,88.05 34.29,85.09 | R39.2 90.99,90.04 96.52,95.57 U2.7
  Bottom 0.254: v6.35,24.61 6.35,19.05 v7.62,17.78
  Bottom 0.406: v99.38,44.45 v87.63,44.45 | v76.52,39.37 65.88,39.37 63.02,36.51 63.02,34.77 U$5.P10
  Bottom 0.61: U2.21 96.52,101.6 U2.7
  Bottom 0.813: U2.7 v83.82,83.82
+5V  (via drill 0.6)
  Top 0.254: C5.1 47.62,73.79 U4_MUX.16 47.57,71.12 v46.51,71.12 | C3.1 3.65,61.12 | U6_MUX.16 56.33,13.65 C2.1 | 43.79,64.9 43.79,64.75
  Top 0.305: 57.18,12.86 C2.1 | 83.19,54.16 C6.1
  Top 0.406: C1.1 97.79,49.53 | 83.03,57.26 U3_MUX.16 | 6.14,62.44 v5.08,63.5 | 67.63,34.29 68.58,33.34 | C25.1 83.95,26.8
  Top 0.61: U$5.P20 66.04,34.29 67.63,34.29 | 68.58,33.34 68.58,32.54 69.85,31.27 69.85,20.48 62.23,12.86 57.18,12.86 | v83.03,58.9 83.03,57.26 | U3_MUX.16 83.19,54.16 | U7_MUX.16 6.14,62.44
  Top 0.813: v1.27,40.64 U$5.P40 | U5_MUX.16 43.79,64.75 C4.1 | v44.13,65.25 43.79,64.9 | 55.88,96.52 57.15,97.79 U$1.VCC 78.74,86.36 85.09,86.36 91.31,80.14 91.31,80.01 | 55.88,96.52 45.56,86.2 v44.29,84.77 | 86.23,29.21 71.12,29.21 69.85,30.48 69.85,31.27 | 4.76,60.01 4.76,57.15 v3.33,55.72 | 4.76,60.01 3.65,61.12 | 4.76,60.01 4.76,63.18 v5.08,63.5 | 118.25,95.39 118.11,95.54 118.11,101.6 119.54,103.03 121.68,103.03 5V.2 | 118.25,95.39 R1.1 | 91.31,80.01 95.25,80.01 | 95.25,80.01 105.41,80.01 115.57,90.17 115.57,92.71 118.25,95.39 | 91.31,80.01 92.71,78.61 v92.71,53.34 96.52,49.53 97.79,49.53 97.79,40.64 86.36,29.21 86.23,29.21 | 86.23,29.21 C25.1 | C26.1 97.66,77.6 95.25,80.01 | C33.1 58.29,94.11 55.88,96.52
  Bottom 0.406: U$1.VCC 78.74,109.22 J2.2 | 5.08,81.28 v5.08,63.5
  Bottom 0.61: v92.71,53.34 88.58,53.34 v83.03,58.9 | v44.29,84.77 44.13,84.61
  Bottom 0.813: v1.27,40.64 1.27,53.98 3.02,55.72 v3.33,55.72 | 5.08,81.28 7.62,83.82 40.8,83.82 41.75,84.77 v44.29,84.77 | 44.13,84.61 44.13,71.12 | 44.13,71.12 v44.13,65.25 | v46.51,71.12 44.13,71.12
+12V
  Top 0.813: 12V.2 118.19,8.89 98.42,8.89 95.89,11.43 FAN2.2 | FAN2.2 FAN3.2 FAN4.2 | FAN1.2 95.89,4.54 FAN2.2
AT_MISO
  Top 0.254: U2.18 102.87,100.33 90.17,100.33 87.63,102.87 87.63,106.68 J2.1
AT_MOSI
  Top 0.254: U2.17 93.98,119.38 81.28,119.38 80.01,118.11 80.01,114.3 J2.4
AT_SCK
  Top 0.254: U2.19 101.6,101.6 93.98,101.6 92.71,102.87 92.71,105.41 86.36,111.76 J2.3
ATCLK3
  Top 0.254: Y1.1 U2.10
  Top 0.305: C32.1 Y1.1
ATCLK4
  Top 0.254: Y1.2 101.6,93.98 U2.9
  Top 0.305: C31.1 Y1.2
DTR
  Top 0.254: U2.6 90.96,99.54 89.22,99.54 86.68,102.08 85.72,102.08 85.09,102.71 85.09,105.41 83.34,107.16 56.83,107.16 53.5,110.49 U$1.DTR
FAN_CTRL
  Top 0.813: FAN4.4 FAN3.4 FAN2.4 90.81,4.38 FAN1.4
  Bottom 0.813: U$5.P3 87.25,28.32 FAN4.4
GND  (via drill 0.6)
  Top 0.254: GPS.P$3 25.4,95.25 29.21,95.25 C27.2 v29.05,101.28 27.52,102.81 GPS.P$8 | C19.2 48.23,56.86 RS_TRANS_5.GND | RS_TRANS_6.GND 3.55,48.55 C14.2 2.54,45.24 v3.81,43.97 | U7_MUX.6 U7_MUX.7 U7_MUX.8 16.51,57.26 v16.51,57.31 | C16.2 42.99,80.2 41.88,81.31 RS_TRANS_8.GND 41.47,81.28 41.91,81.28 v41.91,83.03 | RS_TRANS_1.GND 2.6,68.07 C9.2 1.91,68.45 1.91,60.2 C3.2 3.17,58.42 v1.59,56.83 | C20.2 89.67,42.39 C15.2 | C15.2 89.67,66.36 C17.2 | RS_TRANS_12.GND 80.33,53.21 C6.2 78.74,54.8 78.74,58.42 76.83,60.33 | C13.2 50.77,59.4 48.68,57.31 RS_TRANS_5.GND | RS_TRANS_5.GND 46.83,57.31 v46.04,56.52 | v39.37,56.83 38.6,56.07 C10.2 40.96,52.1 RS_TRANS_3.GND 39.37,51.94 v39.37,51.91 | RS_TRANS_11.GND 47.34,48.39 v47.47,48.26 | C11.2 38.19,47.72 v38.89,48.42 | C5.2 51.09,74.64 50.8,74.93 v50.8,78.11 50.8,81.94 C18.2 | RS_TRANS_7.GND 85.41,52.23 v85.41,53.02 | C15.2 89.67,49.4 v88.27,50.8 | v56.52,67.63 U4_MUX.8 | C4.2 42.23,61.31 RS_TRANS_2.GND 43.31,60.83 v44.13,60.01 | 101.6,49.53 C1.2 100.97,49.4 | RS_TRANS_16.GND 24.26,6.8 C23.2 24.89,5.71 v26.04,5.71 | C21.2 30.61,5.71 | 30.61,5.71 30.61,6.8 RS_TRANS_15.GND | RS_TRANS_14.GND 36.96,6.8 C8.2 37.59,5.71 v38.73,5.71 | 30.61,5.71 30.77,5.56 v32.38,5.56 | U6_MUX.8 U6_MUX.7 U6_MUX.6 v47.62,7.3 | RS_TRANS_13.GND 43.31,6.8 C22.2 v45.24,5.08 | C2.2 v57.15,8.26 | U5_MUX.6 v36.2,69.53 | 76.83,60.33 U3_MUX.6 | 76.83,60.33 v78.42,60.33 | v3.81,27.94 5.08,29.21 5.08,34.29 U$5.P39 3.65,35.72 C12.2 3.81,38.92 6.45,38.92 RS_TRANS_4.GND | RS-485-2.GND 100.97,49.4 | C32.2 103.98,82.9 C31.2 96.52,85.44 96.52,92.71 99.06,95.25 U2.8 | RS_TRANS_9.GND 82.87,71.44 v83.82,72.39
  Top 0.254: 100.97,49.4 100.97,49.69 v102.55,51.28 104.01,49.82 C7.2
  Top 0.305: v46.51,76.36 46.55,76.33 RS_TRANS_10.GND | C24.2 4.26,21.46 RS_TRANS_17.GND v4.76,19.68
  Top 0.406: U4_MUX.6 U4_MUX.7 U4_MUX.8 | U5_MUX.8 U5_MUX.7 U5_MUX.6 | U3_MUX.8 U3_MUX.7 U3_MUX.6 | U2.22 96.52,107.82 C30.2 C29.2 | 29.21,95.25 31.88,95.25 C28.2 | R40.1 v17.94,110.01 | 86.2,24 v86.2,23.97
  Top 0.61: GPS.P$19 v7.95,93.81 v7.94,93.82 | v2.38,104.14 J1.P$1 J1.P$2 7.74,104.31 GPS.P$12
  Top 0.813: D1.C v123.83,89.38 | C25.2 86.17,24 v86.2,23.97 | C26.2 v102.87,77.47 | C33.2 v63.5,93.98
  Bottom 0.254: v39.37,51.91 38.89,51.44 v38.89,48.42
  pour Bottom (isolate 0.203): 0,120.65 0,0 125.73,0 125.73,120.65
GPS_RX
  Top 0.254: GPS.P$10 32.62,105.81 36.83,101.6 69.85,101.6 71.12,100.33 85.09,100.33 U2.4
GPS_TX
  Top 0.254: GPS.P$9 23.96,104.31 22.86,105.41 22.86,106.68 24.13,107.95 34.29,107.95 38.1,104.14 41.91,104.14 43.81,102.23 70.64,102.23 71.75,101.12 85.88,101.12 88.27,98.74 89.85,98.74 91.44,97.16 U2.5
IMU_RX
  Top 0.254: U2.28 80.01,105.41 U$1.RXI
IMU_TX
  Top 0.254: U2.27 81.76,106.2 55.88,106.2 54.13,107.95 U$1.TXO
N$5
  Top 0.254: GPS.P$11 6.34,105.81 J1.P$3
N$6
  Top 0.254: D2.C 18.04,115.32 R40.2
N$7
  Top 0.254: R29.2 101.73,30.19 U$2.6
  Top 0.406: RS-485-2.Z 102.23,34.8 R29.2
N$8
  Top 0.254: R27.1 113.03,29.34 113.03,22.07 U$2.1
  Top 0.406: RS-485-2.A 108.08,37.02 R27.1
N$10
  Top 0.254: R27.2 105.28,31.4 108.27,28.42 108.27,21.11 U$2.2
  Top 0.406: RS-485-2.B 103.5,36.06 R27.2
N$11
  Top 0.254: R29.1 100.33,32.89 100.33,29.21 105.41,24.13 105.41,19.05 106.68,17.78 107.63,17.78 108.27,18.41 108.27,19.84 U$2.3
  Top 0.406: RS-485-2.Y 98.93,38.29 R29.1
N$23
  Top 0.254: GPS.P$5 23.61,98.31 21.59,100.33 21.59,112.17 D2.A
N$45
  Top 0.813: R1.2 118.46,89.48 D1.A
N$47
  Top 0.254: GPS.P$1 25.33,92.26 C27.1
  Top 0.305: FER_BEAD.2 29.63,91.68 C27.1
  Top 0.406: C28.1 32.07,92.39 31.75,92.71 29.5,92.71 C27.1
RESET
  Top 0.254: R39.1 U2.1
  Bottom 0.254: U2.1 83.82,99.06 85.09,99.06 87.63,101.6 87.63,111.92 85.25,114.3 J2.5
RS485_1_RX
  Top 0.254: 11.43,62.23 11.27,62.39 U7_MUX.12 11.27,65.41 6.06,70.61 RS_TRANS_1.RO
RS485_1_TX
  Top 0.254: U7_MUX.1 6.19,60.17 6.83,60.8 6.83,67.63 5.11,69.34 RS_TRANS_1.DI
RS485_2_RX
  Top 0.254: U5_MUX.12 37.47,61.28 37.62,61.12 37.62,55.88 37.31,55.56 37.31,52.23 40.13,49.4 RS_TRANS_3.RO
RS485_2_TX  (via drill 0.6)
  Top 0.254: RS_TRANS_3.DI 42.42,50.67 v42.55,50.8 | v42.55,67.63 U5_MUX.1
  Bottom 0.254: v42.55,50.8 v42.55,67.63
RS485_3_RX  (via drill 0.6)
  Top 0.254: RS_TRANS_5.RO 48.58,59.85 v49.69,60.96 | v53.82,62.71 53.34,63.18 53.34,70.54 U4_MUX.12
  Bottom 0.254: v49.69,60.96 52.07,60.96 v53.82,62.71
RS485_3_TX
  Top 0.254: RS_TRANS_5.DI 47.31,58.58 46.51,59.37 46.51,64.88 U4_MUX.1
RS485_4_RX  (via drill 0.6)
  Top 0.254: RS_TRANS_7.RO v83.19,48.9 | v76.68,52.86 76.68,54.77 78.11,56.2 U3_MUX.12
  Bottom 0.254: v83.19,48.9 79.22,52.86 v76.68,52.86
RS485_4_TX
  Top 0.254: RS_TRANS_7.DI 84.14,50.16 83.34,50.96 83.34,51.75 84.14,52.55 84.14,61.33 U3_MUX.1
RS485_5_RX
  Top 0.254: RS_TRANS_9.RO 82.58,68.61 81.28,67.31 81.28,59.37 80.64,58.74 U3_MUX.14
RS485_5_TX
  Top 0.254: RS_TRANS_9.DI 82.58,69.88 79.69,66.99 79.69,65.41 78.11,63.82 U3_MUX.5
RS485_6_RX
  Top 0.254: RS_TRANS_11.RO 47.91,50.93 49.69,52.7 49.69,54.77 51.75,56.83 51.75,61.75 52.07,62.07 52.07,68.42 50.16,70.33 U4_MUX.14
RS485_6_TX
  Top 0.254: RS_TRANS_11.DI 48.55,49.66 50.16,51.28 50.16,54.13 52.39,56.36 52.39,61.59 52.7,61.91 U4_MUX.5
RS485_7_RX
  Top 0.254: RS_TRANS_2.RO 42.2,58.29 39.05,61.44 39.05,63.66 40.01,64.61 U5_MUX.14
RS485_7_TX
  Top 0.254: RS_TRANS_2.DI 41.72,59.56 39.69,61.59 39.69,63.5 40.64,64.45 40.64,67.47 38.1,70.01 38.1,70.54 U5_MUX.5
RS485_8_RX
  Top 0.254: RS_TRANS_4.RO 9.02,41.4 10.48,42.86 10.48,54.93 10.64,55.09 10.64,59.53 8.73,61.44 U7_MUX.14
RS485_8_TX
  Top 0.254: RS_TRANS_4.DI 9.34,40.13 11.11,41.91 11.11,53.98 11.27,54.13 U7_MUX.5
RS485_9_RX
  Top 0.254: RS_TRANS_6.RO 6.64,51.09 7.78,52.23 7.78,54.77 6.83,55.72 6.83,58.74 7.46,59.37 U7_MUX.15
RS485_9_TX
  Top 0.254: RS_TRANS_6.DI 6.79,49.82 8.57,51.59 8.57,54.93 7.46,56.04 U7_MUX.2
RS485_10_RX
  Top 0.254: U5_MUX.15 41.43,66.15 41.43,69.69 41.91,70.17 41.91,72.39 40.32,73.98 39.37,73.98 38.89,74.45 38.89,76.68 40.99,78.77 RS_TRANS_8.RO
RS485_10_TX
  Top 0.254: U5_MUX.2 41.27,71.91 40.01,73.18 39.21,73.18 38.26,74.14 38.26,77.95 40.32,80.01 41.4,80.01 RS_TRANS_8.DI
RS485_11_RX
  Top 0.254: RS_TRANS_10.RO 48.13,78.87 50.01,76.99 50.01,72.71 48.9,71.6 U4_MUX.15
RS485_11_TX
  Top 0.254: U4_MUX.2 48.9,69.22 48.26,69.85 48.26,72.23 48.58,72.55 48.74,72.55 49.37,73.18 49.37,76.52 48.29,77.6 RS_TRANS_10.DI
RS485_12_RX
  Top 0.254: RS_TRANS_12.RO 80.83,40.04 82.23,41.43 82.23,51.59 81.6,52.23 81.6,54.93 81.92,55.24 U3_MUX.15
RS485_12_TX
  Top 0.254: RS_TRANS_12.DI 80.52,41.31 81.6,42.39 81.6,50.96 80.96,51.59 80.96,55.4 81.28,55.72 81.28,58.42 81.92,59.05 U3_MUX.2
RS485_13_RX  (via drill 0.6)
  Top 0.254: RS_TRANS_13.RO 41.27,8.41 v40.96,8.73 | v52.86,8.73 54.5,8.73 U6_MUX.12
  Bottom 0.254: v40.96,8.73 v52.86,8.73
RS485_13_TX
  Top 0.254: RS_TRANS_13.DI 42.55,7.62 43.5,8.57 45.4,8.57 46.35,7.62 46.35,6.03 48.58,3.81 50.32,3.81 50.8,4.29 50.8,13.02 50.16,13.65 U6_MUX.1
RS485_14_RX  (via drill 0.6)
  Top 0.254: v34.29,3.17 50.64,3.17 51.75,4.29 51.75,10.64 52.23,11.11 U6_MUX.14 | v34.92,8.89 RS_TRANS_14.RO
  Bottom 0.254: v34.29,3.17 34.29,8.26 v34.92,8.89
RS485_14_TX
  Top 0.254: U6_MUX.5 46.2,8.57 45.56,9.21 42.23,9.21 41.91,9.53 38.1,9.53 36.67,8.1 36.67,7.78 RS_TRANS_14.DI
RS485_15_RX  (via drill 0.6)
  Top 0.254: U6_MUX.15 55.24,12.38 55.88,11.75 55.88,8.1 55.72,7.94 53.66,7.94 52.55,6.83 52.55,3.65 50.96,2.06 28.57,2.06 v27.94,2.7 | v27.94,8.89 27.94,7.94 RS_TRANS_15.RO
  Bottom 0.254: v27.94,2.7 v27.94,8.89
RS485_15_TX
  Top 0.254: U6_MUX.2 46.67,12.38 44.45,10.16 31.75,10.16 29.84,8.26 RS_TRANS_15.DI
RS485_16_RX  (via drill 0.6)
  Top 0.254: U6_MUX.11 54.29,7.3 53.34,6.35 53.34,2.54 52.07,1.27 23.34,1.27 v22.23,2.38 | v22.23,8.89 RS_TRANS_16.RO
  Bottom 0.254: v22.23,2.38 v22.23,8.89
RS485_16_TX  (via drill 0.6)
  Top 0.254: U6_MUX.4 v47.62,9.84 | v24.13,8.89 24.13,7.94 RS_TRANS_16.DI
  Bottom 0.254: v47.62,9.84 25.08,9.84 v24.13,8.89
RS485_17_RX  (via drill 0.6)
  Top 0.254: U7_MUX.11 12.54,63.5 13.34,64.29 15.24,64.29 17.94,61.59 17.94,56.99 16.51,55.56 v13.34,55.56 | v11.75,37.47 12.7,36.51 12.7,30.64 8.73,26.67 8.73,24.29 7.94,23.5 6.51,23.5 6.35,23.5 RS_TRANS_17.RO
  Bottom 0.254: v13.34,55.56 13.34,47.94 11.75,46.35 v11.75,37.47
RS485_17_TX  (via drill 0.6)
  Top 0.254: U7_MUX.4 10,58.26 v8.57,59.69 | v3.97,45.88 v7.46,45.88 | v7.62,30.8 v7.62,27.15 | v8.73,22.23 RS_TRANS_17.DI
  Bottom 0.254: v8.57,59.69 6.03,59.69 5.4,59.05 5.4,49.37 3.97,47.94 v3.97,45.88 | v7.62,27.15 7.62,23.34 v8.73,22.23 | v7.62,30.8 7.62,45.72 v7.46,45.88
RS485_18_RX  (via drill 0.6)
  Top 0.305: RS-485-2.RO 104.14,46.67 v104.14,47.62 | v76.83,58.74 U3_MUX.11
  Bottom 0.305: v104.14,47.62 102.71,46.2 88.11,46.2 78.74,55.56 77.47,55.56 76.83,56.2 v76.83,58.74
RS485_18_TX  (via drill 0.6)
  Top 0.305: RS-485-2.DI v102.23,47.62 | v80.33,60.33 79.38,61.28 U3_MUX.4
  Bottom 0.305: v102.23,47.62 89.53,60.33 v80.33,60.33
U2RX  (via drill 0.6)
  Top 0.254: v13.97,30.48 16.51,30.48 17.78,31.75 17.78,34.29 U$5.P33 | v43.18,87.63 54.61,99.06 83.82,99.06 U2.3 | v2.54,82.55 v2.54,73.66
  Bottom 0.254: v43.18,87.63 40.64,85.09 5.08,85.09 v2.54,82.55 | v13.97,30.48 11.43,30.48 10.32,29.37 4.76,29.37 2.54,31.59 2.54,48.26 4.45,50.16 4.45,59.53 2.54,61.44 v2.54,73.66
U2TX
  Bottom 0.254: U2.2 83.82,87.63 78.74,82.55 | 76.2,82.55 U$5.P57
  Bottom 0.305: 78.74,82.55 76.2,82.55
U3_MUX_S0
  Top 0.254: U3_MUX.10 74.93,57.73 74.93,59.69 73.66,60.96 73.66,63.18 74.3,63.82 76.83,63.82 78.9,65.88 78.9,71.28 80.01,72.39 U$5.P44
U3_MUX_S1
  Top 0.254: U3_MUX.9 74.3,59.05 72.39,60.96 72.39,63.02 74.14,64.77 76.2,64.77 78.26,66.83 78.26,71.91 78.74,72.39 78.74,76.83 79.38,77.47 81.28,77.47 U$5.P43
U3RX  (via drill 0.6)
  Top 0.254: U3_MUX.13 79.69,57.42 v79.69,58.74 | v90.96,50.01 90.96,41.43 U$5.P12
  Bottom 0.254: v79.69,58.74 79.69,56.67 86.36,50.01 v90.96,50.01
U3TX  (via drill 0.6)
  Top 0.254: v90.81,62.23 90.81,51.91 92.23,50.48 92.23,40.16 U$5.P11 | v80.33,64.45 80.64,64.14 U3_MUX.3
  Bottom 0.254: v90.81,62.23 88.58,64.45 v80.33,64.45
U4_MUX_S0  (via drill 0.6)
  Top 0.305: U4_MUX.10 v55.24,69.53
  Bottom 0.254: 65.25,74.93 85.57,74.93 86.36,75.72 86.36,77.47
  Bottom 0.305: v55.24,69.53 57.47,69.53 62.87,74.93 65.25,74.93 | 86.36,77.47 U$5.P51
U4_MUX_S1  (via drill 0.6)
  Top 0.305: U4_MUX.9 57.2,71.17 v58.42,72.39
  Bottom 0.254: 63.5,77.47 63.66,77.63 66.2,77.63 U$5.P59
  Bottom 0.305: v58.42,72.39 63.5,77.47
U4RX  (via drill 0.6)
  Top 0.254: 53.29,73.03 v53.66,73.03 52.07,73.03 51.44,72.39 U4_MUX.13
  Bottom 0.254: U$5.P16 78.74,39.37 78.74,40.64 77.47,41.91 74.93,41.91 72.39,44.45 62.23,44.45 58.42,48.26 58.42,50.8 48.26,60.96 48.26,67.63 v53.66,73.03
U4TX  (via drill 0.6)
  Top 0.305: U4_MUX.3 v50.16,67.79
  Bottom 0.254: 54.77,63.82 50.8,67.79 v50.16,67.79
  Bottom 0.305: 54.77,63.82 54.77,62.55 59.05,58.26 67.47,58.26 72.55,53.18 72.55,46.51 76.2,42.86 79.38,42.86 81.92,40.32 81.92,39.21 80.49,37.78 79.69,37.78 U$5.P15
U5_MUX_S0  (via drill 0.6)
  Top 0.254: U5_MUX.10 34.92,67.31 33.5,68.74 v32.07,68.74
  Bottom 0.254: v32.07,68.74 31.27,69.53 25.24,69.53 20.16,74.61 18.1,74.61 U$5.P64
U5_MUX_S1  (via drill 0.6)
  Top 0.254: U5_MUX.9 32.23,65.99 v32.23,66.04 | v25.56,67.79 22.7,70.64 22.7,72.87 19.37,76.2 U$5.P63
  Bottom 0.254: v32.23,66.04 27.3,66.04 v25.56,67.79
U5RX  (via drill 0.6)
  Top 0.254: v39.37,58.42 38.42,59.37 38.42,64.29 38.73,64.61 U5_MUX.13
  Bottom 0.254: v39.37,58.42 34.29,53.34 29.21,53.34 24.13,48.26 16.51,48.26 12.7,44.45 12.7,34.29 U$5.P26
U5TX  (via drill 0.6)
  Top 0.254: U$5.P23 20.32,34.29 v25.4,34.29 | U5_MUX.3 40.01,72.07 39.53,72.55 39.05,72.55 38.58,73.03 33.66,73.03 32.38,71.75 32.38,70.96 30.32,68.9 30.32,66.04 32.07,64.29 33.5,64.29 35.08,62.71 v35.56,62.71
  Bottom 0.254: v25.4,34.29 27.94,36.83 27.94,49.53 30.48,52.07 35.56,52.07 39.37,55.88 40.64,55.88 41.27,56.52 41.27,59.69 38.26,62.71 v35.56,62.71
U6_MUX_S0  (via drill 0.6)
  Top 0.305: U6_MUX.10 56.83,6.03 71.12,20.32 71.12,26.67 v72.39,27.94
  Bottom 0.254: 75.72,31.27 77.47,31.27 78.74,32.54 78.74,34.29 U$5.P14
  Bottom 0.305: v72.39,27.94 75.72,31.27
U6_MUX_S1  (via drill 0.6)
  Top 0.305: U6_MUX.9 56.83,4.76 72.39,20.32 v72.39,25.4
  Bottom 0.254: 79.85,31.27 81.28,32.7 81.28,34.29 U$5.P13
  Bottom 0.305: v72.39,25.4 78.26,31.27 79.85,31.27
U6RX  (via drill 0.6)
  Top 0.254: U6_MUX.13 54.34,10.16 v52.86,10.16
  Bottom 0.254: v52.86,10.16 57.15,14.45 63.98,14.45 69.85,20.32 | 73.66,31.27 73.66,33.66 73.03,34.29 71.12,34.29 U$5.P8
  Bottom 0.305: 69.85,20.32 69.85,27.46 73.66,31.27
U6TX  (via drill 0.6)
  Top 0.254: U6_MUX.3 47.94,11.11 v47.62,11.43
  Bottom 0.254: v47.62,11.43 51.44,15.24 63.5,15.24 68.26,20 68.26,28.1 72.39,32.23 U$5.P7
U7_MUX_S0  (via drill 0.6)
  Top 0.254: U7_MUX.10 13.81,61.12 v13.34,60.64
  Bottom 0.254: v13.34,60.64 10.16,57.47 10.16,54.13 7.62,51.59 7.62,48.42 6.35,47.15 U$5.P38
U7_MUX_S1  (via drill 0.6)
  Top 0.254: U7_MUX.9 v15.08,60.64
  Bottom 0.254: v15.08,60.64 11.27,56.83 11.27,53.82 8.89,51.44 8.89,46.67 8.41,46.2 8.41,41.91 8.89,41.43 U$5.P37
U7RX  (via drill 0.6)
  Top 0.254: v11.43,60.64 10,62.07 U7_MUX.13
  Bottom 0.254: U$5.P28 5.08,34.29 5.08,48.26 6.35,49.53 6.35,52.07 8.89,54.61 8.89,58.1 v11.43,60.64
U7TX  (via drill 0.6)
  Top 0.254: U7_MUX.3 8.89,57.1 8.89,55.88 9.53,55.24 v9.53,43.97
  Bottom 0.254: v9.53,43.97 10.16,43.34 10.16,34.29 U$5.P27

## Text on the board
tPlace: 5V | + | - | Mux 2 | Mux 1 | TI Stellaris | 7 | Mux 3 | Mux 4 | 2 | MRDT | Nov. 2014 | Missouri S&T | Motherboard V3.0 | Today, Tomorrow, Forever | + | 12V | -
tNames: 8 | 10 | 1 | 9 | 2 | 5 | 7 | 3 | 6 | 7 | 2 | 4 | 12 | 17 | 16 | 15 | 14 | 13